# EAGLE design slave_02 (EAGLE 5.08)
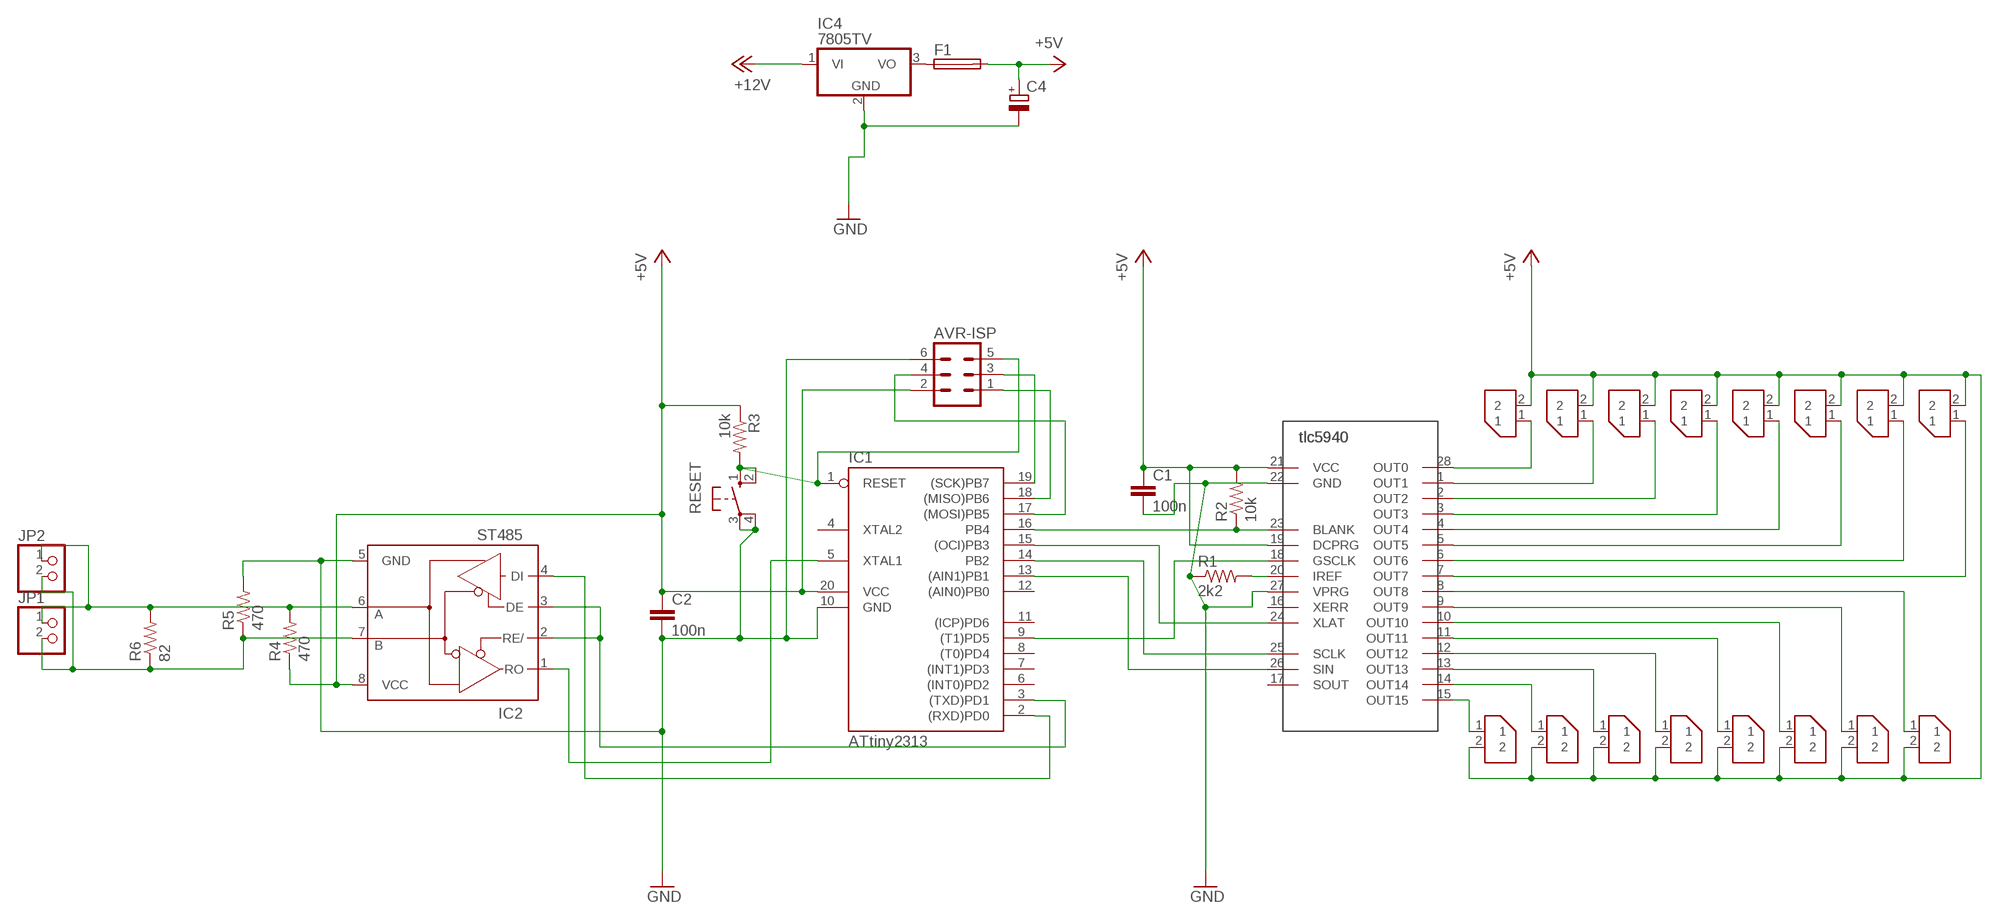
[diagram p0: schematic, sheet 1]

## Parts
AVR-ISP  MA03-2  [MA03-2]
C1  100n  C5/2.5  [C5B2.5]
C2  100n  C2.5/2  [C2.5-2]
C4  CPOL-EUE5-5  [E5-5]
F1  SH22,5A  [SH22,5A]
IC1  ATtiny2313  AT90S2313P  [DIL20]
IC2  ST485  MAX3468CPA  [DIL08]
IC4  7805TV  [TO220V]
JP1  PINHD-1X2  [1X02]
JP2  PINHD-1X2  [1X02]
R1  2k2  R-US_0204/7  [0204/7]
R2  10k  R-US_0207/10  [0207/10]
R3  10k  R-US_0204/7  [0204/7]
R4  470  R-US_0204/7  [0204/7]
R5  470  R-US_0204/7  [0204/7]
R6  82  R-US_0204/7  [0204/7]
RESET  10-XX  [B3F-10XX]
U$1  TLC5940-NT  [28-DIL-300]
U$2  SPOX-22-03-5025  [SPOX-22-03-5025]
U$3  SPOX-22-03-5025  [SPOX-22-03-5025]
U$4  SPOX-22-03-5025  [SPOX-22-03-5025]
U$5  SPOX-22-03-5025  [SPOX-22-03-5025]
U$6  SPOX-22-03-5025  [SPOX-22-03-5025]
U$7  SPOX-22-03-5025  [SPOX-22-03-5025]
U$8  SPOX-22-03-5025  [SPOX-22-03-5025]
U$9  SPOX-22-03-5025  [SPOX-22-03-5025]
U$10  SPOX-22-03-5025  [SPOX-22-03-5025]
U$11  SPOX-22-03-5025  [SPOX-22-03-5025]
U$12  SPOX-22-03-5025  [SPOX-22-03-5025]
U$13  SPOX-22-03-5025  [SPOX-22-03-5025]
U$14  SPOX-22-03-5025  [SPOX-22-03-5025]
U$15  SPOX-22-03-5025  [SPOX-22-03-5025]
U$16  SPOX-22-03-5025  [SPOX-22-03-5025]
U$17  SPOX-22-03-5025  [SPOX-22-03-5025]

## Nets
+5V: AVR-ISP.2 C1.1 C2.1 C4.+ F1.2 IC1.20(VCC) IC2.8(VCC) R2.2 R3.1 R4.1 U$1.19(DCPRG) U$1.21(VCC) U$2.2 U$3.2 U$4.2 U$5.2 U$6.2 U$7.2 U$8.2 U$9.2 U$10.2 U$11.2 U$12.2 U$13.2 U$14.2 U$15.2 U$16.2 U$17.2
+12V: IC4.1(VI)
GND: AVR-ISP.6 C1.2 C2.2 C4.- IC1.10(GND) IC2.5(GND) IC4.2(GND) R1.1 R5.2 RESET.3(P) RESET.4(P1) U$1.22(GND) U$1.27(VPRG)
N$1: IC1.15((OCI)PB3) U$1.24(XLAT)
N$2: IC1.16(PB4) R2.1 U$1.23(BLANK)
N$3: IC1.9((T1)PD5) U$1.18(GSCLK)
N$4: IC1.14(PB2) U$1.25(SCLK)
N$5: IC1.13((AIN1)PB1) U$1.26(SIN)
N$6: R1.2 U$1.20(IREF)
N$7: IC1.3((TXD)PD1) IC2.2(RE/) IC2.3(DE)
N$8: AVR-ISP.1 IC1.18((MISO)PB6)
N$9: IC1.2((RXD)PD0) IC2.4(DI)
N$10: IC1.5(XTAL1) IC2.1(RO)
N$11: AVR-ISP.3 IC1.19((SCK)PB7)
N$12: F1.1 IC4.3(VO)
N$13: U$1.28(OUT0) U$2.1
N$14: AVR-ISP.4 IC1.17((MOSI)PB5)
N$15: U$1.1(OUT1) U$3.1
N$16: U$1.2(OUT2) U$4.1
N$17: U$1.3(OUT3) U$5.1
N$18: U$1.15(OUT15) U$10.1
N$19: U$1.14(OUT14) U$11.1
N$20: U$1.13(OUT13) U$12.1
N$21: U$1.12(OUT12) U$13.1
N$22: U$1.11(OUT11) U$14.1
N$23: U$1.10(OUT10) U$15.1
N$24: U$1.9(OUT9) U$16.1
N$25: U$1.8(OUT8) U$17.1
N$26: U$1.4(OUT4) U$6.1
N$27: U$1.5(OUT5) U$7.1
N$28: U$1.6(OUT6) U$8.1
N$29: U$1.7(OUT7) U$9.1
N$31: AVR-ISP.5 IC1.1(RESET) R3.2 RESET.1(S) RESET.2(S1)
N$32: IC2.7(B) JP1.2 JP2.2 R5.1 R6.1
N$35: IC2.6(A) JP1.1 JP2.1 R4.2 R6.2
Unconnected: IC1.4(XTAL2) IC1.6((INT0)PD2) IC1.7((INT1)PD3) IC1.8((T0)PD4) IC1.11((ICP)PD6) IC1.12((AIN0)PB0) U$1.16(XERR) U$1.17(SOUT)

## Library data of the parts
AVR-ISP = con-lstb:MA03-2: PIN HEADER
C1 C2 = capacitor-wima:C: CAPACITOR naming: grid - package width
C4 = resistor:CPOL-EU: POLARIZED CAPACITOR, European symbol
F1 = fuse:SH22,5A: FUSE HOLDER grid 22,5mm, isolated cap OGN0031 8201, Schurter (Buerklin)
IC1 = atmel:AT90S2313: MICROCONTROLLER 2 Kbytes FLASH 128 bytes SRAM 128 bytes EEPROM UART
IC2 = maxim:MAX34*: +5V, Fail-Safe, 40Mbps, Profibus RS-485/RS-422 Transceivers Source: MAX3465-MAX3469.pdf
IC4 = linear:78*: Positive VOLTAGE REGULATOR Source: http://cache.national.com/ds/LM/LM78L05.pdf http://www.fairchildsemi.com/ds/LM/LM7805.pdf
JP1 JP2 = pinhead:PINHD-1X2: PIN HEADER
R1-R6 = resistor:R-US_: RESISTOR, American symbol
RESET = switch-omron:10-XX: OMRON SWITCH
U$1 = TLC5490:TLC5940-NT
U$2-U$17 = damians_bits:SPOX-22-03-5025: SPOX 22-03-5025

## Board
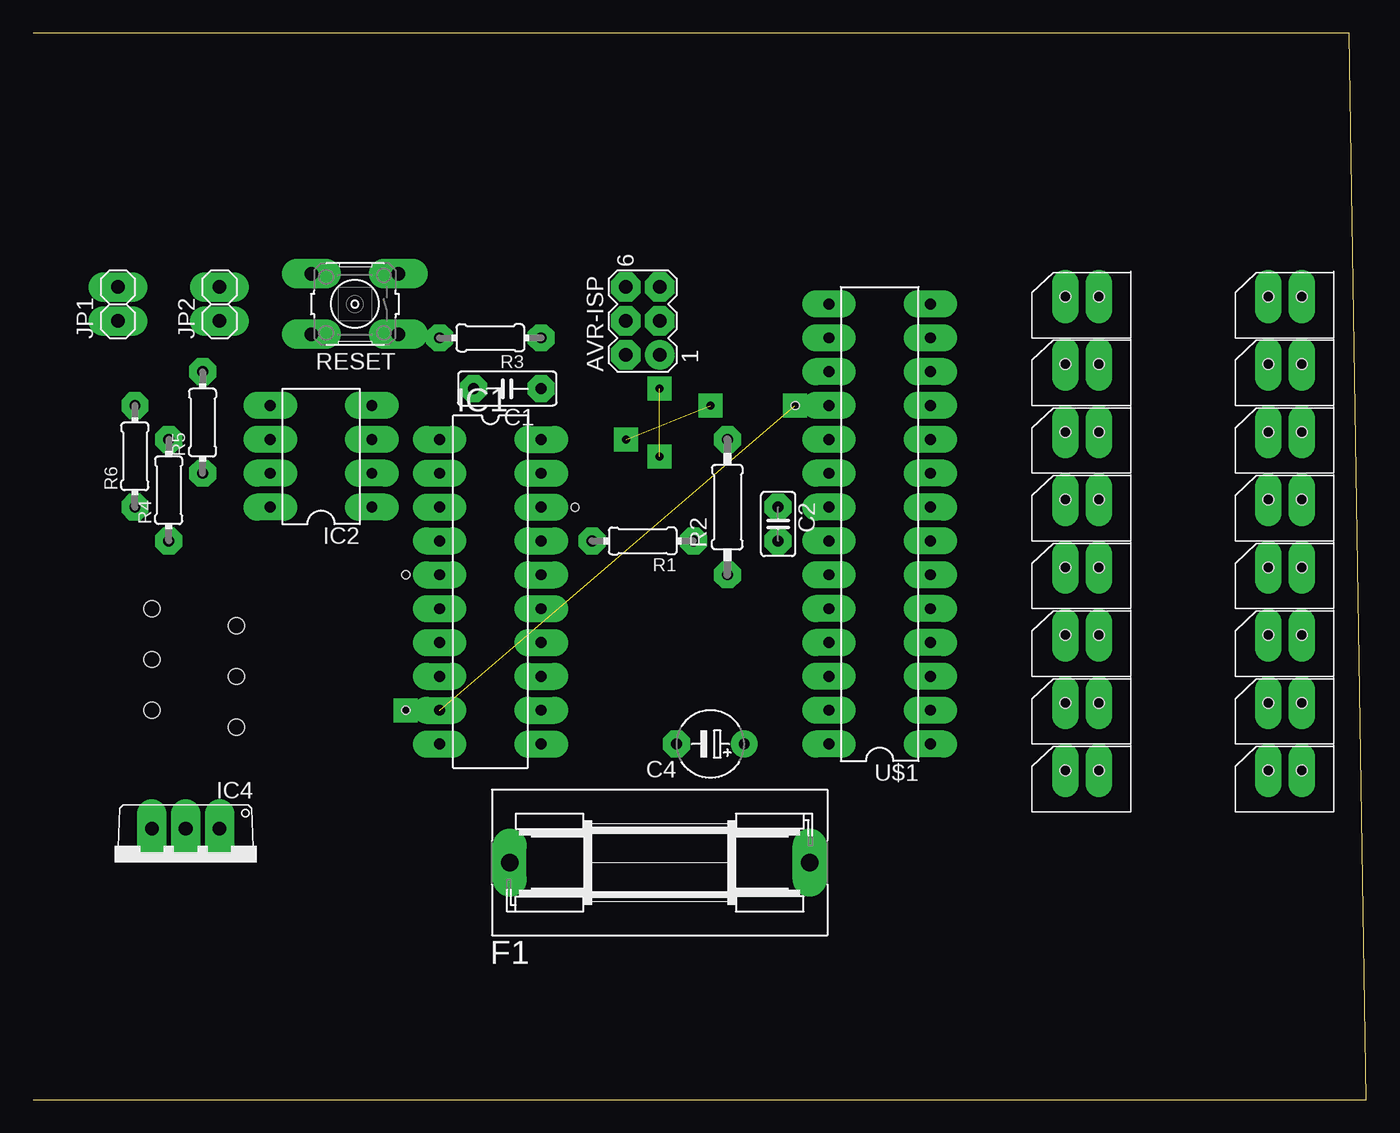
[diagram p1: board, top side]
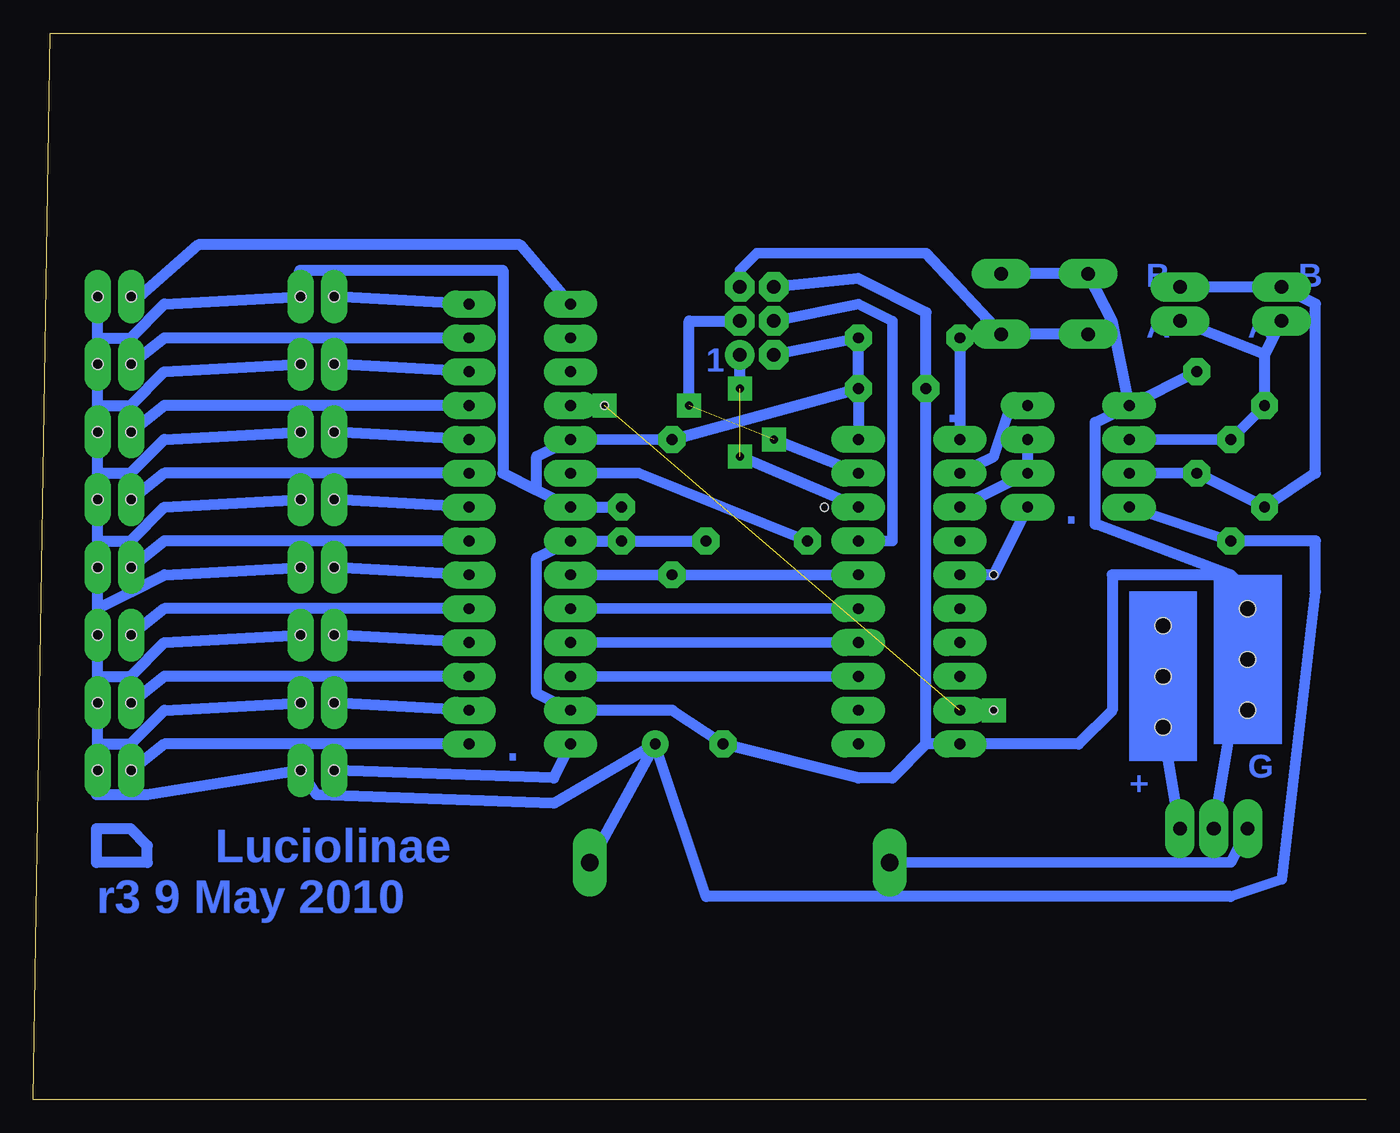
[diagram p2: board, bottom side, seen from below]

Size 100 x 80 mm. Coordinates in mm from the lower left corner, seen from the top.
Outline: 0,0 100,0 98.73,80 0,80
Copper layers (1*16): Top 0.035mm / dielectric 1.5mm / Bottom 0.035mm
Design rules "hobby": minimum track width 0.8mm, minimum drill 0.8mm, track to track 0.8mm, track to pad 0.8mm, pad to pad 0.45mm, via to via 0.8mm, smd to smd 8mil, copper to edge 10mil, drill to drill 8mil, minimum pad ring 0.6mm, minimum via ring 0.6mm, stop-mask expansion 0mil, vias tented up to drill 0mil, thermal gap 10mil
Holes 1.2 mm at 8.89,29.21 15.24,27.94 8.89,33.02 15.24,31.75 8.89,36.83 15.24,35.56
Holes 0.6 mm at 57.15,52.07 27.94,29.21 27.94,39.37 40.64,44.45

### Footprints (pad centres in the part's own frame; a part is rotated, then mirrored left to right if it is on the bottom)
MA03-2 = drill 1.016 round: 1 -2.54,-1.27 | drill 1.016 octagon: 2 -2.54,1.27; 3 0,-1.27; 4 0,1.27; 5 2.54,-1.27; 6 2.54,1.27
C5B2.5 = drill 0.813 pad 1.6 octagon: 1 -2.54,0; 2 2.54,0
C2.5-2 = drill 0.813 pad 1.6 octagon: 1 -1.27,0; 2 1.27,0
E5-5 = drill 0.813 pad 1.905 round: + -2.54,0 | drill 0.813 pad 1.905 octagon: - 2.54,0
SH22,5A = drill 1.321 pad 2.54 long: 1 -11.252,0; 2 11.252,0
DIL20 = drill 0.813 long: 1 -11.43,-3.81; 2 -8.89,-3.81; 3 -6.35,-3.81; 4 -3.81,-3.81; 5 -1.27,-3.81; 6 1.27,-3.81; 7 3.81,-3.81; 8 6.35,-3.81; 9 8.89,-3.81; 10 11.43,-3.81; 11 11.43,3.81; 12 8.89,3.81; 13 6.35,3.81; 14 3.81,3.81; 15 1.27,3.81; 16 -1.27,3.81; 17 -3.81,3.81; 18 -6.35,3.81; 19 -8.89,3.81; 20 -11.43,3.81
DIL08 = drill 0.813 long: 1 -3.81,-3.81; 2 -1.27,-3.81; 3 1.27,-3.81; 4 3.81,-3.81; 5 3.81,3.81; 6 1.27,3.81; 7 -1.27,3.81; 8 -3.81,3.81
TO220V = drill 1.016 long: 1 -2.54,-2.54; 2 0,-2.54; 3 2.54,-2.54
1X02 = drill 1.016 long: 1 -1.27,0; 2 1.27,0
0204/7 = drill 0.813 octagon: 1 -3.81,0; 2 3.81,0
0207/10 = drill 0.813 octagon: 1 -5.08,0; 2 5.08,0
B3F-10XX = drill 1.016 long: 1 -3.251,2.261; 2 3.251,2.261; 3 -3.251,-2.261; 4 3.251,-2.261
28-DIL-300 = drill 0.813 long: 1 -15.24,-3.81; 2 -12.7,-3.81; 3 -10.16,-3.81; 4 -7.62,-3.81; 5 -5.08,-3.81; 6 -2.54,-3.81; 7 0,-3.81; 8 2.54,-3.81; 9 5.08,-3.81; 10 7.62,-3.81; 11 10.16,-3.81; 12 12.7,-3.81; 13 15.24,-3.81; 14 17.78,-3.81; 15 17.78,3.81; 16 15.24,3.81; 17 12.7,3.81; 18 10.16,3.81; 19 7.62,3.81; 20 5.08,3.81; 21 2.54,3.81; 22 0,3.81; 23 -2.54,3.81; 24 -5.08,3.81; 25 -7.62,3.81; 26 -10.16,3.81; 27 -12.7,3.81; 28 -15.24,3.81
SPOX-22-03-5025 = drill 0.8 long: 1 2.5,3.1; 2 5,3.1 | hole 0.8: 2.5,3.1; 5,3.1

### Placement (x,y rotation side)
AVR-ISP  45.72,58.42 90 top
C1  35.56,53.34 180 top
C2  55.88,43.18 270 top
C4  50.8,26.67 180 top
F1  46.99,17.78 0 top
IC1  34.29,38.1 270 top
IC2  21.59,48.26 90 top
IC4  11.43,17.78 180 top
JP1  6.35,59.69 90 top
JP2  13.97,59.69 90 top
R1  45.72,41.91 180 top
R2  52.07,44.45 90 top
R3  34.29,57.15 180 top
R4  10.16,45.72 90 top
R5  12.7,50.8 90 top
R6  7.62,48.26 90 top
RESET  24.13,59.69 180 top
U$1  63.5,41.91 90 top
U$2  74.93,21.59 0 top
U$3  90.17,21.59 0 top
U$4  74.93,26.67 0 top
U$5  90.17,26.67 0 top
U$6  74.93,31.75 0 top
U$7  90.17,31.75 0 top
U$8  74.93,36.83 0 top
U$9  90.17,36.83 0 top
U$10  90.17,57.15 0 top
U$11  74.93,57.15 0 top
U$12  90.17,52.07 0 top
U$13  74.93,52.07 0 top
U$14  90.17,46.99 0 top
U$15  74.93,46.99 0 top
U$16  90.17,41.91 0 top
U$17  74.93,41.91 0 top

### Tracks (layer width: path | path; a pad name or v marks a point on that pad's centre or on a via)
+5V
  Bottom 0.8: R4.1 IC2.8 | U$1.19 R2.2 | 3.81,38.1 6.35,16.51 10.16,15.24 | R3.1 AVR-ISP.2
  Bottom 0.813: 95.17,41.91 U$9.2 95.17,36.83 | 95.17,41.91 U$16.2 95.17,46.99 | 95.17,36.83 U$7.2 95.17,31.75 | 95.17,31.75 U$5.2 95.17,26.67 | U$6.2 90.17,34.29 92.71,31.75 95.17,31.75 | U$8.2 90.17,39.37 92.71,38.1 95.17,36.83 | U$17.2 90.17,44.45 92.71,41.91 95.17,41.91 | 95.17,26.67 U$3.2 95.25,22.86 91.44,22.86 U$2.2 78.74,22.86 60.96,22.23 C4.+ | U$4.2 90.17,29.21 92.71,26.67 95.17,26.67 | 95.17,57.15 U$12.2 95.17,52.07 | 95.17,57.15 U$10.2 | 95.17,52.07 U$14.2 95.17,46.99 | U$15.2 90.17,49.53 92.71,46.99 95.17,46.99 | U$13.2 90.17,54.61 92.71,52.07 95.17,52.07 | 95.17,57.15 92.71,57.15 90.17,59.69 U$11.2 80.01,62.23 64.77,62.23 64.77,46.99 62.23,45.72 | 62.23,45.72 U$1.21 C2.1 | U$1.19 62.23,48.26 62.23,45.72 | 3.81,38.1 3.81,41.91 R4.1 | C1.1 IC1.20 | C1.1 R3.1 | C4.+ F1.2 | 10.16,15.24 49.53,15.24 C4.+ | R2.2 C1.1
+12V
  Bottom 0.813: IC4.1 15.24,27.94
GND
  Bottom 0.813: RESET.3 RESET.4 19.05,58.42 IC2.5 | R1.1 C2.2 U$1.22 62.23,40.64 62.23,30.48 U$1.27 52.07,29.21 C4.- 38.1,24.13 35.56,24.13 33.02,26.67 | AVR-ISP.6 38.1,61.59 33.02,59.05 C1.2 33.02,26.67 | 33.02,26.67 IC1.10 21.59,26.67 19.05,29.21 19.05,39.37 10.16,39.37 | IC2.5 R5.2 | IC4.2 10.16,27.94 8.89,38.1 10.16,39.37 | 10.16,39.37 20.32,43.18 20.32,50.8 IC2.5
N$1
  Bottom 0.8: IC1.15 U$1.24
N$2
  Bottom 0.8: U$1.23 R2.1 IC1.16
N$3  (via drill 0.6)  (1 unrouted)
  Bottom 0.813: v57.15,52.07 U$1.18 | v27.94,29.21 IC1.9
N$4
  Bottom 0.8: IC1.14 U$1.25
N$5
  Bottom 0.8: IC1.13 U$1.26
N$6
  Bottom 0.8: U$1.20 54.61,46.99 R1.2
N$7
  Bottom 0.813: IC2.3 IC2.2 IC1.3
N$8  (via drill 0.6)  (1 unrouted)
  Bottom 0.813: IC1.18 v46.99,48.26 | v46.99,53.34 AVR-ISP.1
N$9
  Bottom 0.813: IC2.4 26.67,52.07 27.94,48.26 IC1.2
N$10
  Bottom 0.813: IC2.1 27.94,39.37 IC1.5
N$11  (via drill 0.6)  (1 unrouted)
  Bottom 0.813: IC1.19 v44.45,49.53 | AVR-ISP.3 50.8,58.42 v50.8,52.07
N$12
  Bottom 0.8: IC4.3 10.16,17.78 F1.1
N$13
  Bottom 0.813: U$1.28 60.96,24.13 U$2.1
N$14
  Bottom 0.8: IC1.17 35.56,41.91 35.56,58.42 38.1,59.69 AVR-ISP.4
N$15
  Bottom 0.813: U$3.1 90.17,26.67 U$1.1
N$16
  Bottom 0.813: U$1.2 U$4.1
N$17
  Bottom 0.813: U$5.1 90.17,31.75 U$1.3
N$18
  Bottom 0.813: U$1.15 63.5,64.14 87.63,64.14 92.71,59.69 U$10.1
N$19
  Bottom 0.813: U$1.14 U$11.1
N$20
  Bottom 0.813: U$12.1 90.17,57.15 U$1.13
N$21
  Bottom 0.813: U$1.12 U$13.1
N$22
  Bottom 0.813: U$1.11 90.17,52.07 U$14.1
N$23
  Bottom 0.813: U$1.10 U$15.1
N$24
  Bottom 0.813: U$16.1 90.17,46.99 U$1.9
N$25
  Bottom 0.813: U$1.8 U$17.1
N$26
  Bottom 0.813: U$1.4 U$6.1
N$27
  Bottom 0.813: U$7.1 90.17,36.83 U$1.5
N$28
  Bottom 0.813: U$1.6 U$8.1
N$29
  Bottom 0.813: U$9.1 90.17,41.91 U$1.7
N$30
  Bottom 0.813: 92.71,20.32 95.25,20.32 95.25,17.78 91.44,17.78 91.44,19.05 92.71,20.32
N$31
  Bottom 0.8: AVR-ISP.5 46.99,62.23 45.72,63.5 33.02,63.5
  Bottom 0.813: RESET.1 R3.2 IC1.1 | RESET.1 33.02,63.5 | RESET.2 RESET.1
N$32
  Bottom 0.8: R5.1 IC2.7
  Bottom 0.813: R5.1 R6.1 3.81,46.99 3.81,59.69 JP1.2 JP2.2
N$35
  Bottom 0.8: R6.2 R4.2 IC2.6
  Bottom 0.813: 7.62,55.88 JP1.1 | R6.2 7.62,55.88 | 7.62,55.88 JP2.1
(copper drawn outside any net)
  shapes: Bottom area x5

### Text on the board
Bottom: B | B | A | A | 1 | . | . | . | G | + | Luciolinae | r3 9 May 2010